# EAGLE design LED_Matrix_3_2_Power (EAGLE 7.7.0)
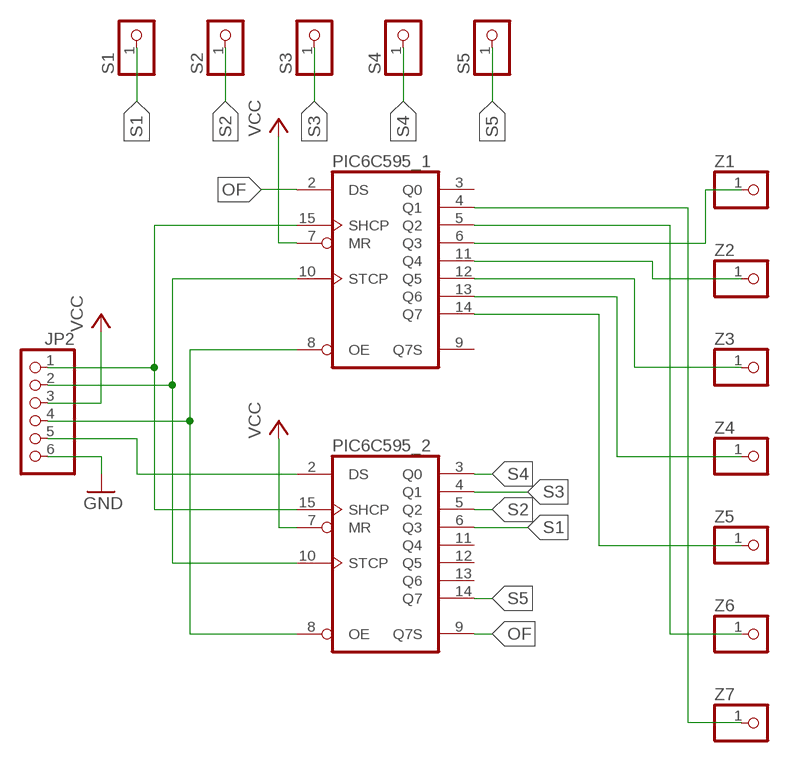
[diagram p0: schematic, sheet 1]

## Parts
JP2  PINHD-1X6  [1X06]
PIC6C595_1  PIC6C595D  [SO16]
PIC6C595_2  PIC6C595D  [SO16]
S1  PINHD-1X1  [1X01]
S2  PINHD-1X1  [1X01]
S3  PINHD-1X1  [1X01]
S4  PINHD-1X1  [1X01]
S5  PINHD-1X1  [1X01]
Z1  PINHD-1X1  [1X01]
Z2  PINHD-1X1  [1X01]
Z3  PINHD-1X1  [1X01]
Z4  PINHD-1X1  [1X01]
Z5  PINHD-1X1  [1X01]
Z6  PINHD-1X1  [1X01]
Z7  PINHD-1X1  [1X01]

## Nets
GND: JP2.6
N$1: JP2.2 PIC6C595_1.10(STCP) PIC6C595_2.10(STCP)
N$2: JP2.1 PIC6C595_1.15(SHCP) PIC6C595_2.15(SHCP)
N$3: JP2.5 PIC6C595_2.2(DS)
N$4: PIC6C595_1.4(Q1) Z7.1
N$5: PIC6C595_1.6(Q3) Z1.1
N$6: JP2.4 PIC6C595_1.8(OE) PIC6C595_2.8(OE)
N$8: PIC6C595_1.5(Q2) Z6.1
N$10: PIC6C595_1.14(Q7) Z5.1
N$11: PIC6C595_1.13(Q6) Z4.1
N$12: PIC6C595_1.12(Q5) Z3.1
N$13: PIC6C595_1.11(Q4) Z2.1
OF: PIC6C595_1.2(DS) PIC6C595_2.9(Q7S)
S1: PIC6C595_2.6(Q3) S1.1
S2: PIC6C595_2.5(Q2) S2.1
S3: PIC6C595_2.4(Q1) S3.1
S4: PIC6C595_2.3(Q0) S4.1
S5: PIC6C595_2.14(Q7) S5.1
VCC: JP2.3 PIC6C595_1.7(MR) PIC6C595_2.7(MR)
Unconnected: PIC6C595_1.3(Q0) PIC6C595_1.9(Q7S) PIC6C595_2.11(Q4) PIC6C595_2.12(Q5) PIC6C595_2.13(Q6)

## Power pins joined to a net without a drawn wire
GND: PIC6C595_1.16(GND) PIC6C595_2.16(GND)
VCC: PIC6C595_1.1(VCC) PIC6C595_2.1(VCC)

## Library data of the parts
JP2 = pinhead:PINHD-1X6: PIN HEADER
PIC6C595_1 PIC6C595_2 = PIC6C595:PIC6C595: Power Logic 8-Bit Shift Register The PIC6C595 is an 8-bit serial-in/serial or parallel-out shift register with a storage register and open-drain outputs designed for use in systems that require relatively moderate load power such as LEDs. The device contains a built-in voltage clamp on the outputs for inductive transient protection. Power driver applications include relays, solenoids, and other low-current or medium-voltage loads.
S1-S5 Z1-Z7 = pinhead:PINHD-1X1: PIN HEADER

## Board
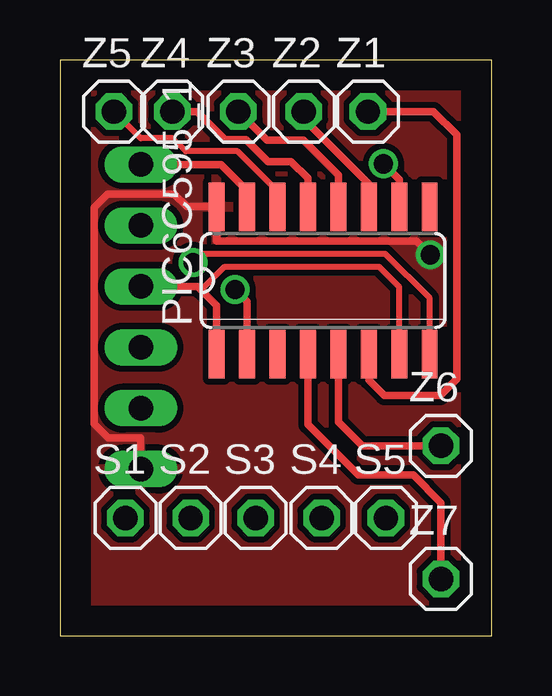
[diagram p1: board, top side]
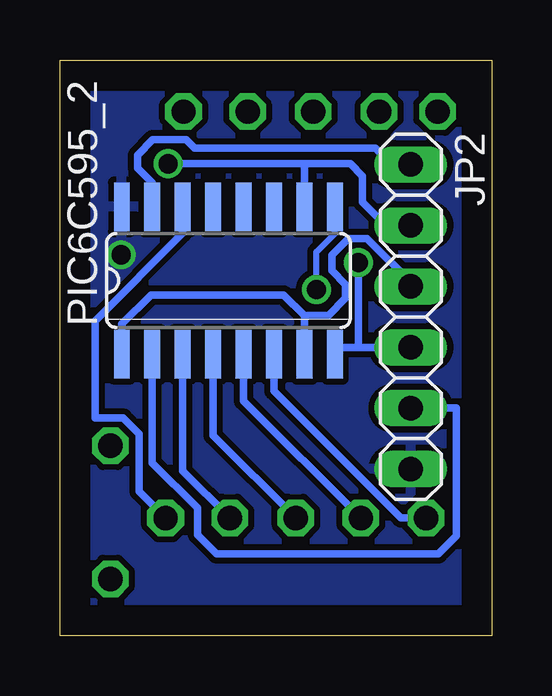
[diagram p2: board, bottom side, seen from below]

Size 18 x 24 mm. Coordinates in mm from the lower left corner, seen from the top.
Outline: 0,0 18,0 18,24 0,24 0,0
Copper layers (1*16): Top 0.035mm / dielectric 1.5mm / Bottom 0.035mm
Design rules "default *": minimum track width 10mil, minimum drill 24mil, track to track 8mil, track to pad 8mil, pad to pad 8mil, via to via 8mil, smd to smd 8mil, copper to edge 50mil, drill to drill 8mil, minimum pad ring 10mil, minimum via ring 8mil, stop-mask expansion 4mil, vias tented up to drill 0mil, thermal gap 10mil
tRestrict: area 16.5,1.4 to 16.6,1.5; area 7.1,13.1 to 7.3,13.4
bRestrict: area 6,13.1 to 6.2,13.3; area 13.9,6.1 to 14.2,6.3; area 2,5.8 to 2.1,6

### Footprints (pad centres in the part's own frame; a part is rotated, then mirrored left to right if it is on the bottom)
1X06 = drill 1.016 long: 1 -6.35,0; 2 -3.81,0; 3 -1.27,0; 4 1.27,0; 5 3.81,0; 6 6.35,0
SO16 = smd 0.66 x 2.032: 1 -4.445,-3.073; 2 -3.175,-3.073; 3 -1.905,-3.073; 4 -0.635,-3.073; 5 0.635,-3.073; 6 1.905,-3.073; 7 3.175,-3.073; 8 4.445,-3.073; 9 4.445,3.073; 10 3.175,3.073; 11 1.905,3.073; 12 0.635,3.073; 13 -0.635,3.073; 14 -1.905,3.073; 15 -3.175,3.073; 16 -4.445,3.073
1X01 = drill 1.016 octagon: 1 0,0

### Placement (x,y rotation side)
JP2  3.37,13.29 270 bottom
PIC6C595_1  10.97,14.8 0 top
PIC6C595_2  10.97,14.8 0 bottom
S1  2.73,4.9 0 top
S2  5.45,4.9 0 top
S3  8.16,4.9 0 top
S4  10.91,4.9 0 top
S5  13.6,4.9 0 top
Z1  12.85,21.85 0 top
Z2  10.17,21.85 0 top
Z3  7.44,21.85 0 top
Z4  4.68,21.85 0 top
Z5  2.25,21.85 0 top
Z6  15.89,7.92 0 top
Z7  15.89,2.36 0 top

### Tracks (layer width: path | path; a pad name or v marks a point on that pad's centre or on a via)
GND  (via drill 0.8)
  Top 0.305: JP2.6 3.37,8.25 2,8.25 1.43,8.82 1.43,17.85 1.99,18.41 4.76,18.41 5.29,17.88 PIC6C595_1.16 6.53,16.45 14.87,16.45 v15.45,15.87
  pour Bottom (isolate 0.254): 0.09,23.86 0.09,0.17 17.9,0.17 17.9,23.82 11.9,23.82
  pour Top (isolate 0.254): 0.13,23.86 17.91,23.86 17.91,0.17 0.1,0.17 0.1,15.84
N$1  (via drill 0.8)
  Top 0.305: PIC6C595_1.10 14.15,19.01 v13.49,19.67
  Bottom 0.305: v13.49,19.67 7.8,19.67 | 7.8,19.67 5.89,19.67 5.38,19.16 5.38,18.07 4.41,17.1 JP2.2 | PIC6C595_2.10 7.8,19.67
N$2
  Top 0.305: PIC6C595_1.15 7.8,18.56 6.72,19.64 JP2.1
  Bottom 0.305: PIC6C595_2.15 14.15,18.88 14.77,19.5 14.77,20.03 14.13,20.67 12.73,20.67 12.39,20.32 4.83,20.32 4.15,19.64 JP2.1
N$3
  Bottom 0.305: PIC6C595_2.2 14.15,7.21 12.26,5.31 12.26,4.2 11.47,3.41 2.22,3.41 1.47,4.16 1.47,9.48 JP2.5
N$4
  Top 0.305: PIC6C595_1.4 10.34,8.81 12.46,6.69 14.73,6.69 15.89,5.53 Z7.1
N$5
  Top 0.305: Z1.1 15.58,21.85 16.55,20.88 16.55,10.69 15.87,10.01 13.53,10.01 12.88,10.66 PIC6C595_1.6
N$6  (via drill 0.8)
  Top 0.254: PIC6C595_1.8 15.42,14.06 13.56,15.92 5.93,15.92 v5.56,15.55
  Bottom 0.305: 6.53,12.05 PIC6C595_2.8 6.53,12.02 5.6,12.02 5.56,12.02 | JP2.4 5.56,12.02 | v5.56,15.55 5.56,12.02
N$7
  pour Top (isolate 0.254): -0.61,24.86 18.82,24.86 18.82,-0.46 -0.76,-0.46 -0.76,14
N$8
  Top 0.305: Z6.1 12.61,7.92 11.61,8.91 PIC6C595_1.5
N$10
  Top 0.254: PIC6C595_1.14 9.07,18.53 7.41,20.19 5.25,20.19 4.71,20.74 3.37,20.74 Z5.1
N$11
  Top 0.305: Z4.1 5.71,21.85 6.89,20.68 7.77,20.68 8.5,19.95 8.68,19.77 9.64,19.77 10.34,19.07 PIC6C595_1.13
N$12
  Top 0.305: Z3.1 8.63,20.66 10.16,20.66 11.61,19.2 PIC6C595_1.12
N$13
  Top 0.305: Z2.1 10.17,21.53 12.88,18.82 PIC6C595_1.11
N$14
  pour Bottom (isolate 0.254): -0.29,24.27 18.33,24.27 18.33,-0.42 -0.38,-0.42 -0.38,19.46
OF  (via drill 0.8)
  Top 0.305: v7.3,14.42 7.8,13.93 PIC6C595_1.2
  Bottom 0.254: PIC6C595_2.9 6.53,16.77 7.3,15.99 v7.3,14.42
S1
  Bottom 0.305: S1.1 3.77,4.9 9.07,10.2 PIC6C595_2.6
S2
  Bottom 0.305: S2.1 10.34,9.79 PIC6C595_2.5
S3
  Bottom 0.305: S3.1 11.61,8.34 PIC6C595_2.4
S4
  Bottom 0.305: S4.1 12.88,6.87 PIC6C595_2.3
S5
  Bottom 0.305: S5.1 14.71,6.01 14.71,8.41 15.37,9.08 16.54,9.08 16.54,13.12 12.88,16.78 PIC6C595_2.14
VCC
  Top 0.254: PIC6C595_1.7 14.15,14.54 13.31,15.38 6.87,15.38 5.89,14.4
  Top 0.305: PIC6C595_1.1 6.53,13.76 5.89,14.4 5.73,14.56 JP2.3
  Bottom 0.305: PIC6C595_2.7 7.81,11.74 7.81,13.34 | PIC6C595_2.1 15.42,12.99 14.21,14.21 8.68,14.21 7.81,13.34 | JP2.3 3.37,14.73 5.2,16.56 5.96,16.56 6.67,15.86 6.67,15.21 6.09,14.63 6.09,14.07 6.81,13.34 7.81,13.34

### Text on the board
Document: Zusatzanzeiger / -> Steuerungsplatine